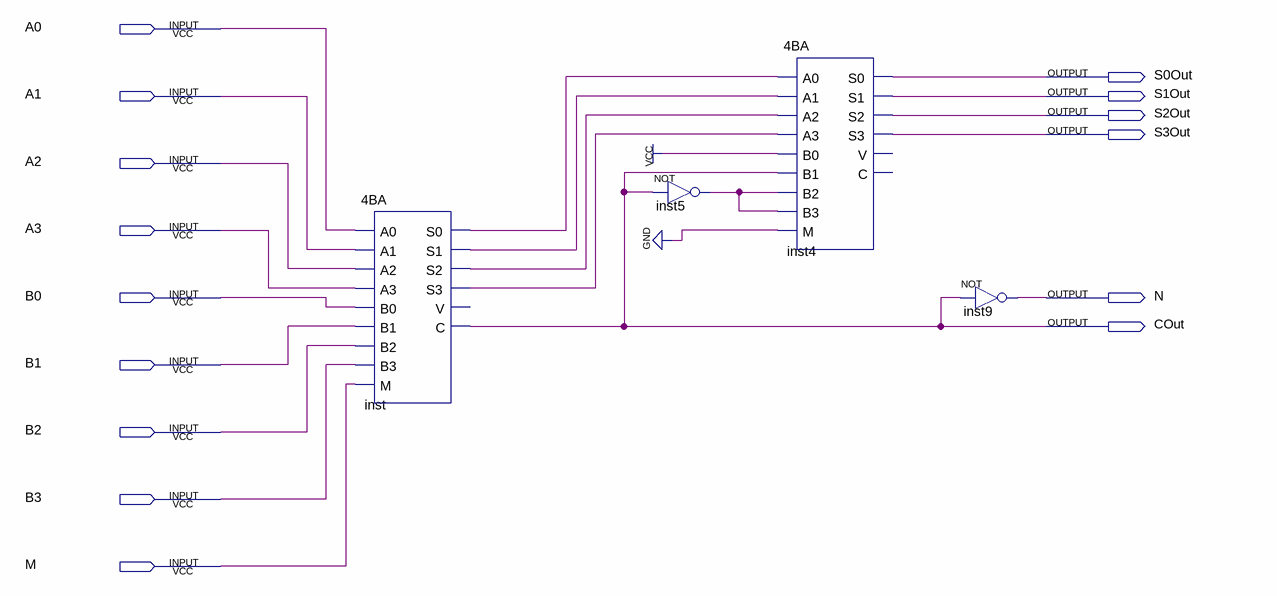
[diagram p0: schematic sheet]
// Quartus schematic Lab04.bdf as structural Verilog: 4 symbols, 15 pins
module Lab04 (
  input  A0,
  input  A1,
  input  A2,
  input  A3,
  input  B0,
  input  B1,
  input  B2,
  input  B3,
  input  M,
  output S0Out,
  output S1Out,
  output S2Out,
  output S3Out,
  output N,
  output COut
);

  wire inst5_out, inst_s0, inst_s1, inst_s2, inst_s3;

  \4BA  inst (
    .A0(A0), .A1(A1), .A2(A2), .A3(A3), .B0(B0), .B1(B1), .B2(B2), .B3(B3), .M(M), .S0(inst_s0),
    .S1(inst_s1), .S2(inst_s2), .S3(inst_s3), .C(COut));  // open: V
  not inst5 (inst5_out, COut);
  \4BA  inst4 (
    .A0(inst_s0), .A1(inst_s1), .A2(inst_s2), .A3(inst_s3), .B0(1'b1), .B1(COut), .B2(inst5_out),
    .B3(inst5_out), .M(1'b0), .S0(S0Out), .S1(S1Out), .S2(S2Out), .S3(S3Out));  // open: V, C
  not inst9 (N, COut);
endmodule
